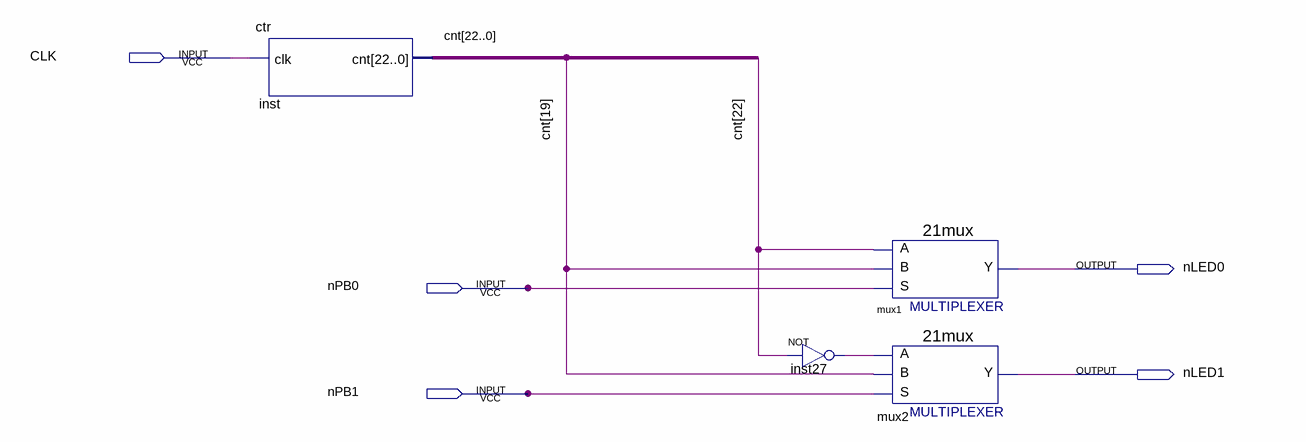
[diagram p0: schematic sheet]
// Quartus schematic Component.bdf as structural Verilog: 4 symbols, 5 pins
module Component (
  input  CLK,
  input  nPB0,
  input  nPB1,
  output nLED0,
  output nLED1
);

  wire inst27_out;
  wire [22:0] cnt;

  ctr inst (.clk(CLK), .cnt(cnt));
  not inst27 (inst27_out, cnt[22]);
  \21mux  mux1 (.S(nPB0), .B(cnt[19]), .A(cnt[22]), .Y(nLED0));
  \21mux  mux2 (.S(nPB1), .B(cnt[19]), .A(inst27_out), .Y(nLED1));
endmodule
